# EAGLE design UWED (EAGLE 7.6.0)
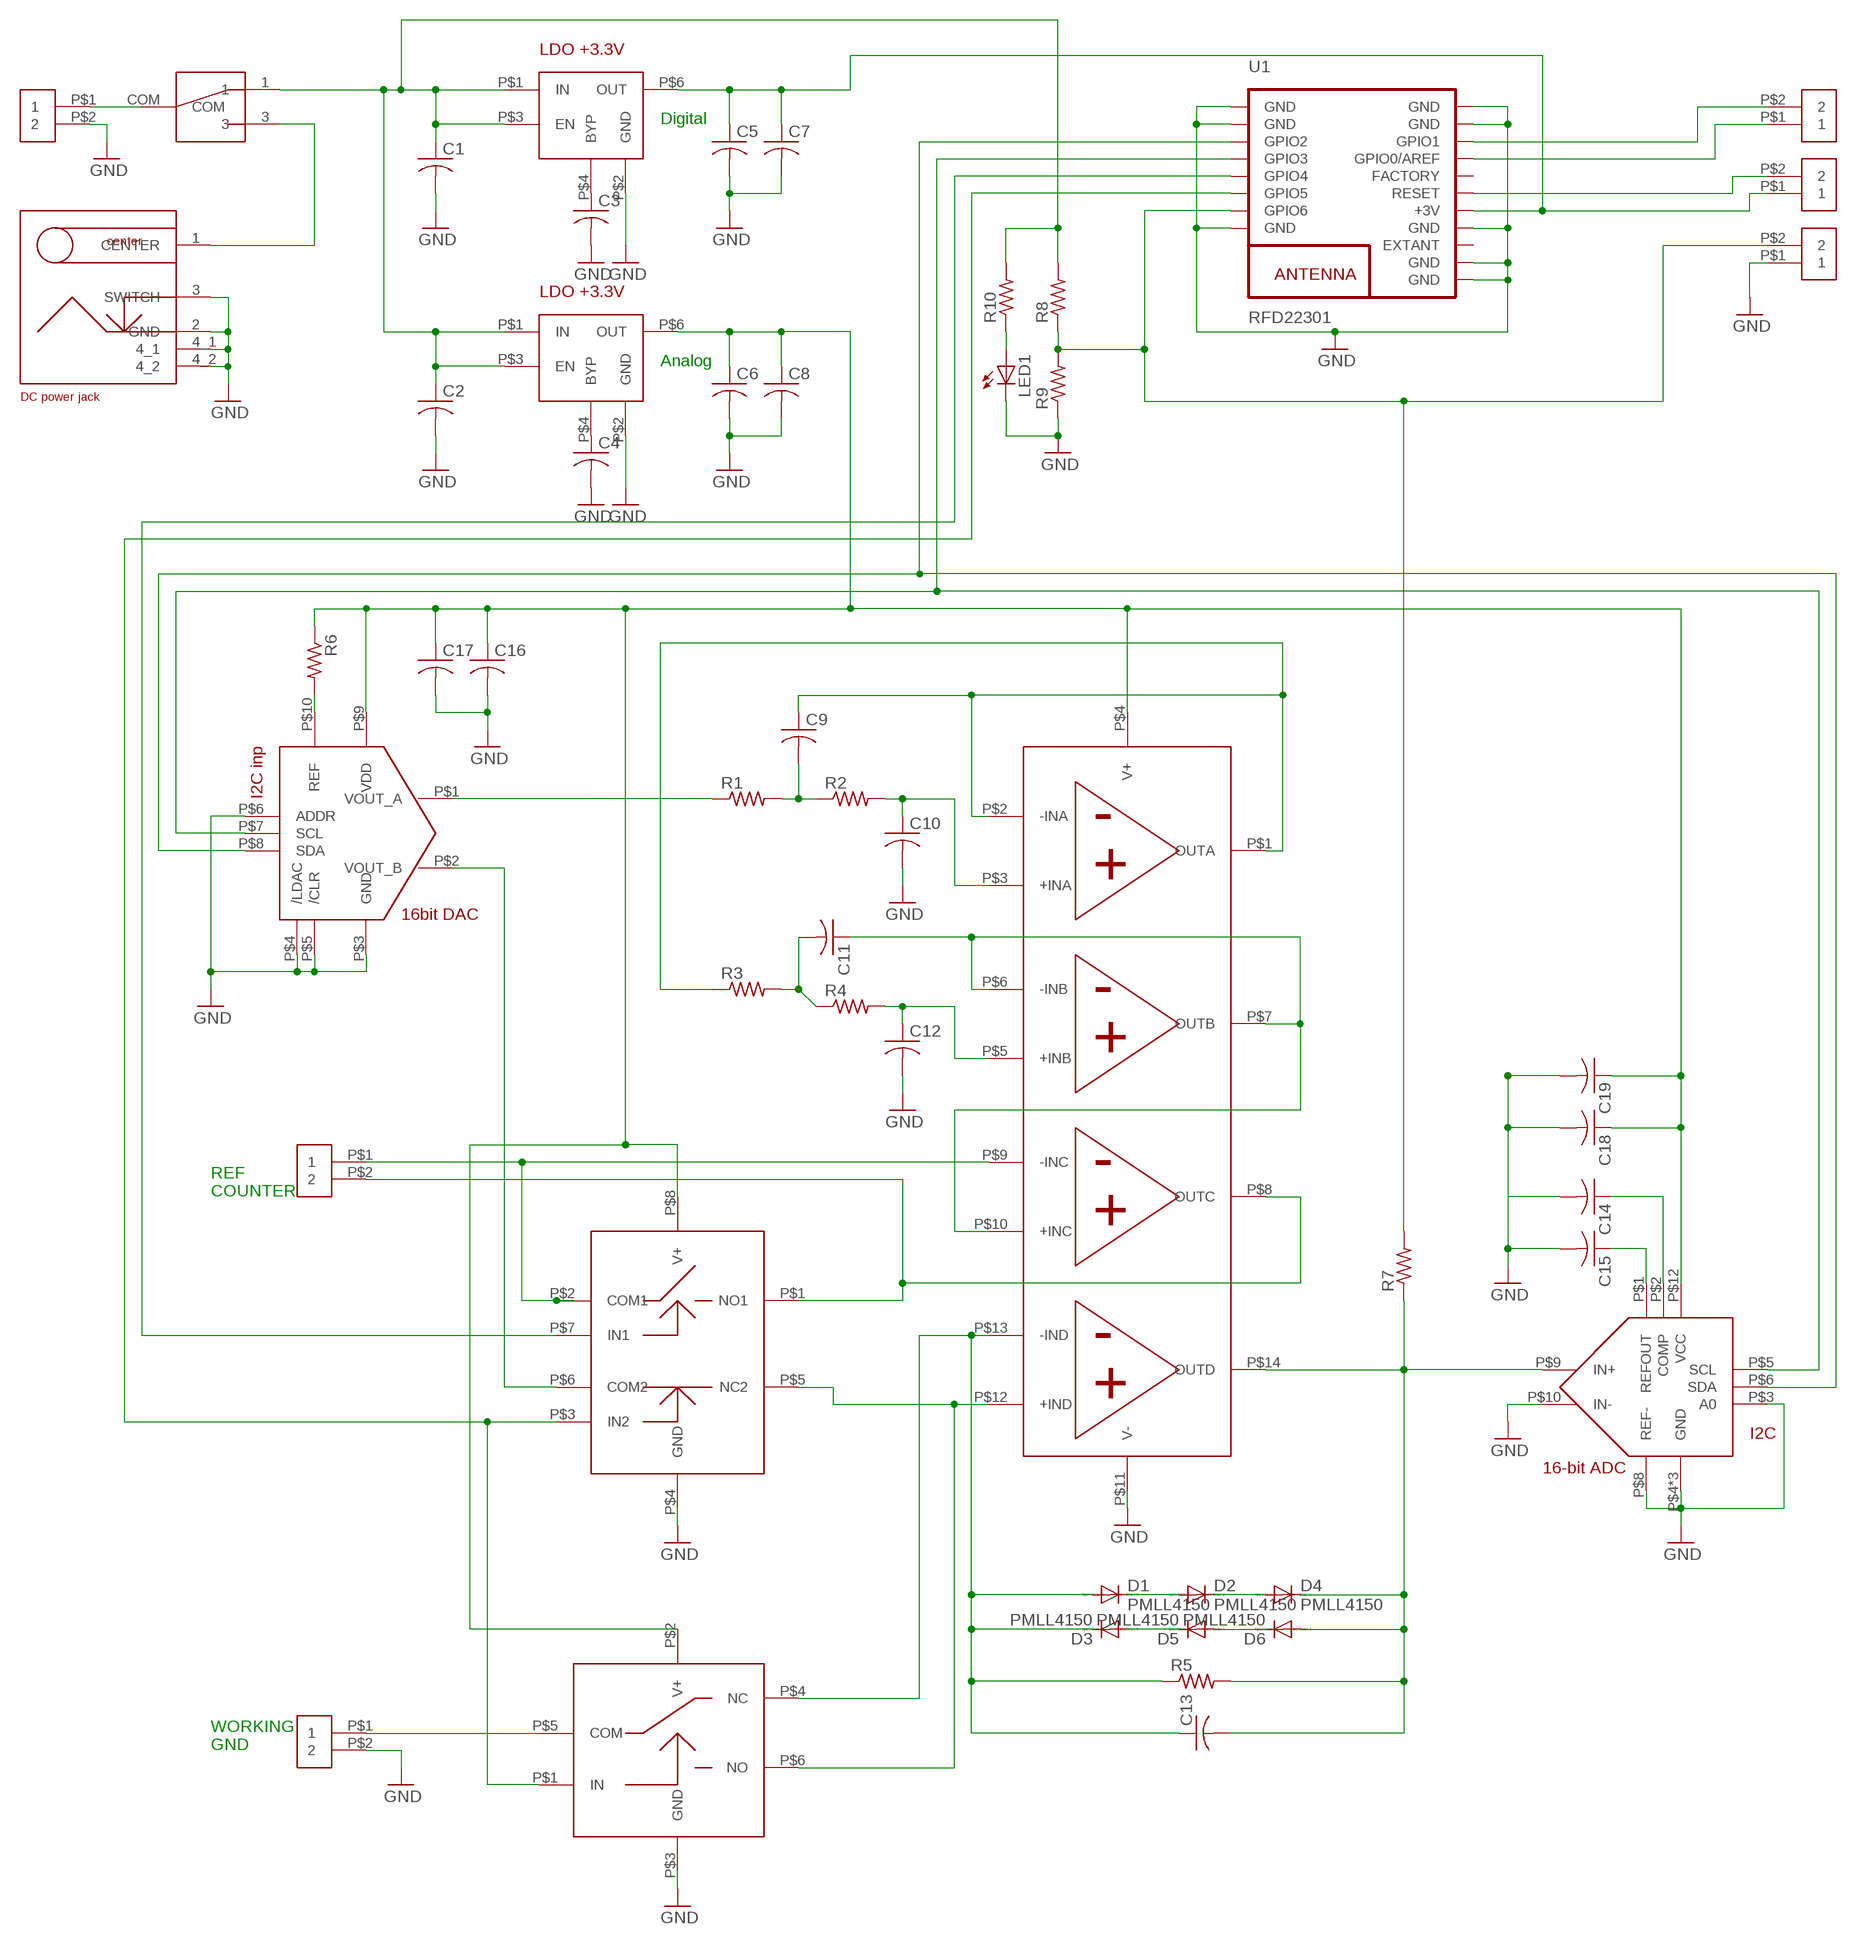
[diagram p0: schematic, sheet 1]

## Parts
C1  C-USC0805  [C0805]
C2  C-USC0805  [C0805]
C3  C-USC0805  [C0805]
C4  C-USC0805  [C0805]
C5  C-USC0805  [C0805]
C6  C-USC0805  [C0805]
C7  C-USC0805  [C0805]
C8  C-USC0805  [C0805]
C9  C-USC0805  [C0805]
C10  C-USC0805  [C0805]
C11  C-USC0805  [C0805]
C12  C-USC0805  [C0805]
C13  C-USC0805  [C0805]
C14  C-USC0805  [C0805]
C15  C-USC0805  [C0805]
C16  C-USC0805  [C0805]
C17  C-USC0805  [C0805]
C18  C-USC0805  [C0805]
C19  C-USC0805  [C0805]
D1  PMLL4150  [SOD80C]
D2  PMLL4150  [SOD80C]
D3  PMLL4150  [SOD80C]
D4  PMLL4150  [SOD80C]
D5  PMLL4150  [SOD80C]
D6  PMLL4150  [SOD80C]
LED1  LEDSML0805  [SML0805]
R1  R-US_R0805  [R0805]
R2  R-US_R0805  [R0805]
R3  R-US_R0805  [R0805]
R4  R-US_R0805  [R0805]
R5  R-US_R0805  [R0805]
R6  R-US_R0805  [R0805]
R7  R-US_R0805  [R0805]
R8  R-US_R0805  [R0805]
R9  R-US_R0805  [R0805]
R10  R-US_R0805  [R0805]
U1  RFD22301  [RFD22301]
U$1  4OPAMPS-AD8608ARUZ  [MSOP14_0.65MM]
U$2  ADC_LTC2471IMS  [MSOP12_0.65MM]
U$3  CONTACT_PADS_SMD_2  [CONTACT_PADS_SMD_2]
U$4  CONTACT_PADS_SMD_2  [CONTACT_PADS_SMD_2]
U$5  CONTACT_PADS_SMD_2  [CONTACT_PADS_SMD_2]
U$6  CONTACT_PADS_SMD_2  [CONTACT_PADS_SMD_2]
U$7  CONTACT_PADS_SMD_2  [CONTACT_PADS_SMD_2]
U$8  DAC_AD5667RBRMZ-2  [MSOP10_0.5MM]
U$9  DC_JACK_0.7MM  [PJ-032H-SMT]
U$10  LDO-MIC5205-3.3YM5-TR  [SOT-23-6]
U$11  LDO-MIC5205-3.3YM5-TR  [SOT-23-6]
U$12  SWITCH_MAX4643EUA  [MSOP8_0.65MM]
U$13  SWITCH_MAX4644EUT  [SOT-23-6]
U$14  SW_TOGGLELARGE  [TOGGLE_34E]
U$15  CONTACT_PADS_SMD_2  [CONTACT_PADS_SMD_2]

## Nets
GND: C1.2 C2.2 C3.2 C4.2 C5.2 C6.2 C7.2 C8.2 C10.2 C12.2 C14.2 C15.2 C16.2 C17.2 C18.2 C19.2 LED1.C R9.1 U1.1(GND) U1.2(GND) U1.8(GND) U1.9(GND) U1.10(GND) U1.12(GND) U1.18(GND) U1.19(GND) U$1.P$11(V-) U$2.P$3(A0) U$2.P$4(GND) U$2.P$7(GND) U$2.P$8(REF-) U$2.P$10(IN-) U$2.P$11(GND) U$3.P$2 U$6.P$2 U$8.P$3(GND) U$8.P$4(/LDAC) U$8.P$5(/CLR) U$8.P$6(ADDR) U$9.2(GND) U$9.3(SWITCH) U$9.4_1 U$9.4_2 U$10.P$2(GND) U$11.P$2(GND) U$12.P$4(GND) U$13.P$3(GND) U$15.P$1
N$1: U$3.P$1 U$14.COM
N$2: U$9.1(CENTER) U$14.3
N$3: C1.1 C2.1 R8.2 R10.2 U$10.P$1(IN) U$10.P$3(EN) U$11.P$1(IN) U$11.P$3(EN) U$14.1
N$4: C3.1 U$10.P$4(BYP)
N$5: C4.1 U$11.P$4(BYP)
N$6: C6.1 C8.1 C16.1 C17.1 C18.1 C19.1 R6.1 U$1.P$4(V+) U$2.P$12(VCC) U$8.P$9(VDD) U$11.P$6(OUT) U$12.P$8(V+) U$13.P$2(V+)
N$7: C5.1 C7.1 U1.13(+3V) U$4.P$1 U$10.P$6(OUT)
N$8: C9.1 R3.1 U$1.P$1(OUTA) U$1.P$2(-INA)
N$9: R1.1 U$8.P$1(VOUT_A)
N$10: C9.2 R1.2 R2.1
N$11: U$1.P$8(OUTC) U$7.P$2 U$12.P$1(NO1)
N$12: C10.1 R2.2 U$1.P$3(+INA)
N$13: C11.1 U$1.P$6(-INB) U$1.P$7(OUTB) U$1.P$10(+INC)
N$14: C11.2 R3.2 R4.1
N$15: C12.1 R4.2 U$1.P$5(+INB)
N$16: U$1.P$9(-INC) U$7.P$1 U$12.P$2(COM1)
N$17: U$6.P$1 U$13.P$5(COM)
N$18: C13.1 D1.A D3.C R5.1 U$1.P$13(-IND) U$13.P$4(NC)
N$19: U$1.P$12(+IND) U$12.P$5(NC2) U$13.P$6(NO)
N$20: U1.6(GPIO5) U$12.P$3(IN2) U$13.P$1(IN)
N$21: C13.2 D4.C D6.A R5.2 R7.1 U$1.P$14(OUTD) U$2.P$9(IN+)
N$22: D5.A D6.C
N$23: D3.A D5.C
N$24: D2.C D4.A
N$25: D1.C D2.A
N$26: U$8.P$2(VOUT_B) U$12.P$6(COM2)
N$27: U1.3(GPIO2) U$2.P$6(SDA) U$8.P$8(SDA)
N$28: C15.1 U$2.P$1(REFOUT)
N$29: C14.1 U$2.P$2(COMP)
N$30: R6.2 U$8.P$10(REF)
N$31: U1.4(GPIO3) U$2.P$5(SCL) U$8.P$7(SCL)
N$34: U1.17(GPIO1) U$5.P$2
N$35: U1.16(GPIO0/AREF) U$5.P$1
N$36: U1.14(RESET) U$4.P$2
N$39: U1.5(GPIO4) U$12.P$7(IN1)
N$43: R7.2 R8.1 R9.2 U1.7(GPIO6) U$15.P$2
N$45: LED1.A R10.1
Unconnected: U1.11(EXTANT) U1.15(FACTORY)

## Notes on the sheet
- Digital
- Analog
- REF
  COUNTER
- WORKING
  GND

## Library data of the parts
C1-C19 = rcl:C-US: CAPACITOR, American symbol
D1-D6 = diode:PMLL4150: DIODE high speed
LED1 = led:LED: LED OSRAM: - CHIPLED LG R971, LG N971, LY N971, LG Q971, LY Q971, LO R971, LY R971 LH N974, LH R974 LS Q976, LO Q976, LY Q976 LO Q996 - Hyper CHIPLED LW Q18S LB Q993, LB Q99A, LB R99A - SideLED LS A670, LO A670, LY A670, LG A670, LP A670 LB A673, LV A673, LT A673, LW A673 LH A674 LY A675 LS A676, LA A676, LO A676, LY A676, LW A676 LS A679, LY A679, LG A679 - Hyper Micro SIDELED® LS Y876, LA Y876, LO Y876, LY Y876 LT Y87S - SmartLED LW L88C, LW L88S LB L89C, LB L89S, LG L890 LS L89K, LO L89K, LY L89K LS L896, LA L896, LO L896, LY L896 - TOPLED LS T670, LO T670, LY T670, LG T670, LP T670 LSG T670, LSP T670, LSY T670, LOP T670, LYG T670 LG T671, LOG T671, LSG T671 LB T673, LV T673, LT T673, LW T673 LH T674 LS T676, LA T676, LO T676, LY T676, LB T676, LH T676, LSB T676, LW T676 LB T67C, LV T67C, LT T67C, LS T67K, LO T67K, LY T67K, LW E67C LS E67B, LA E67B, LO E67B, LY E67B, LB E67C, LV E67C, LT E67C LW T67C LS T679, LY T679, LG T679 LS T770, LO T770, LY T770, LG T770, LP T770 LB T773, LV T773, LT T773, LW T773 LH T774 LS E675, LA E675, LY E675, LS T675 LS T776, LA T776, LO T776, LY T776, LB T776 LHGB T686 LT T68C, LB T68C - Hyper Mini TOPLED® LB M676 - Mini TOPLED Santana® LG M470 LS M47K, LO M47K, LY M47K Source: http://www.osram.convergy.de LUXEON: - LUMILED® LXK2-PW12-R00, LXK2-PW12-S00, LXK2-PW14-U00, LXK2-PW14-V00 LXK2-PM12-R00, LXK2-PM12-S00, LXK2-PM14-U00 LXK2-PE12-Q00, LXK2-PE12-R00, LXK2-PE12-S00, LXK2-PE14-T00, LXK2-PE14-U00 LXK2-PB12-K00, LXK2-PB12-L00, LXK2-PB12-M00, LXK2-PB14-N00, LXK2-PB14-P00, LXK2-PB14-Q00 LXK2-PR12-L00, LXK2-PR12-M00, LXK2-PR14-Q00, LXK2-PR14-R00 LXK2-PD12-Q00, LXK2-PD12-R00, LXK2-PD12-S00 LXK2-PH12-R00, LXK2-PH12-S00 LXK2-PL12-P00, LXK2-PL12-Q00, LXK2-PL12-R00 Source: www.luxeon.com KINGBRIGHT: KA-3528ASYC Source: www.kingbright.com
R1-R10 = rcl:R-US_: RESISTOR, American symbol
U1 = RF_Digital_RFD22301_Eagle_Schematic_PCB_Library:RFD22301: RFD22301 RFduino SMT Module RFD22301 Datasheet: http://www.rfdigital.com/wp-content/uploads/2014/03/RFD22301.Data_.Sheet_.11.24.13_11.38PM.pdf
U$1 = AlarsLibrary:4OPAMPS-AD8608ARUZ
U$2 = AlarsLibrary:ADC_LTC2471IMS
U$3-U$7 U$15 = AlarsLibrary:CONTACT_PADS_SMD_2
U$8 = AlarsLibrary:DAC_AD5667RBRMZ-2
U$9 = AlarsLibrary:DC_JACK_0.7MM
U$10 U$11 = AlarsLibrary:LDO-MIC5205-3.3YM5-TR
U$12 = AlarsLibrary:SWITCH_MAX4643EUA
U$13 = AlarsLibrary:SWITCH_MAX4644EUT
U$14 = AlarsLibrary:SW_TOGGLE

## Board
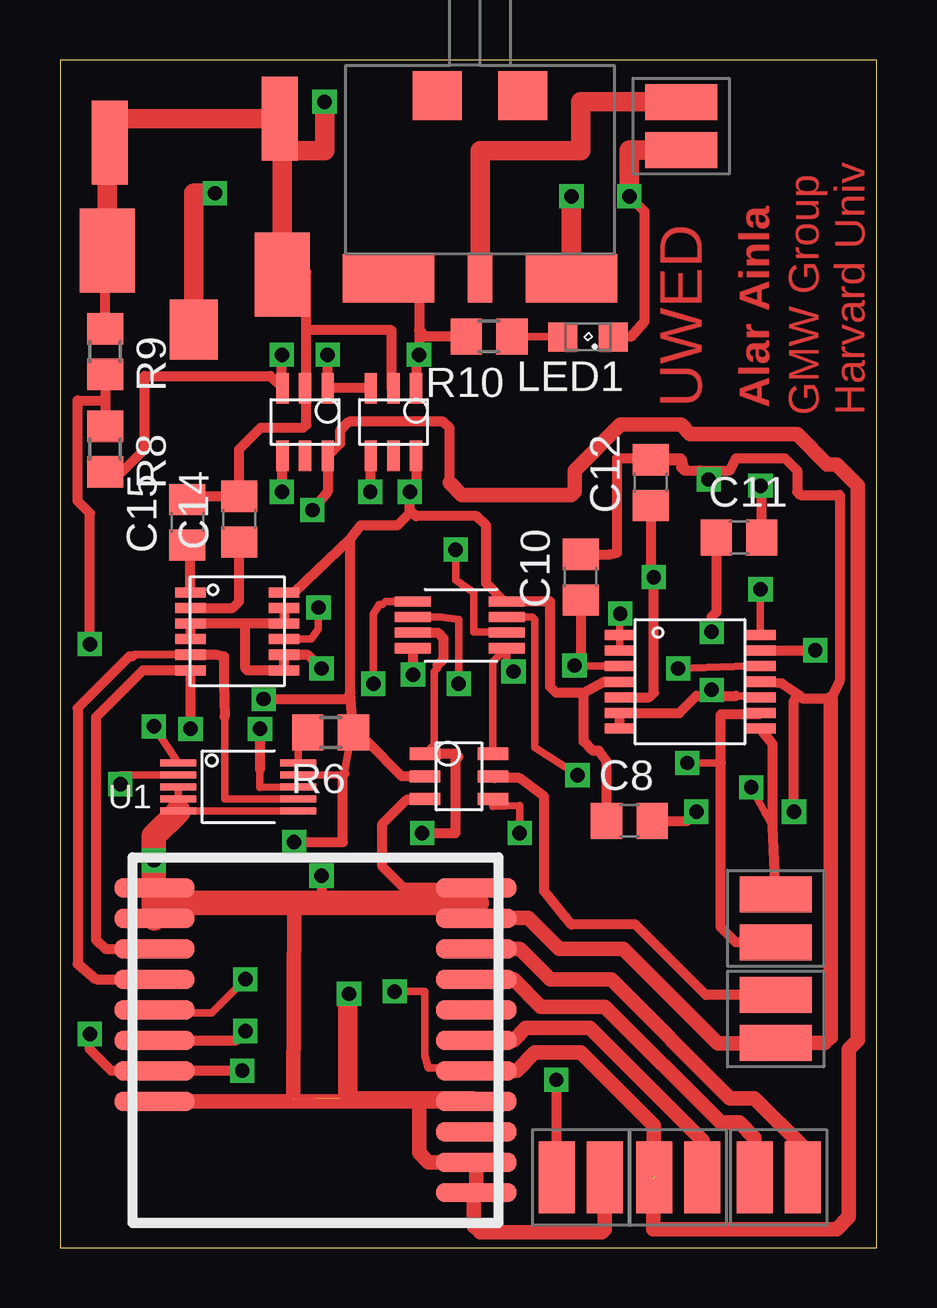
[diagram p1: board, top side]
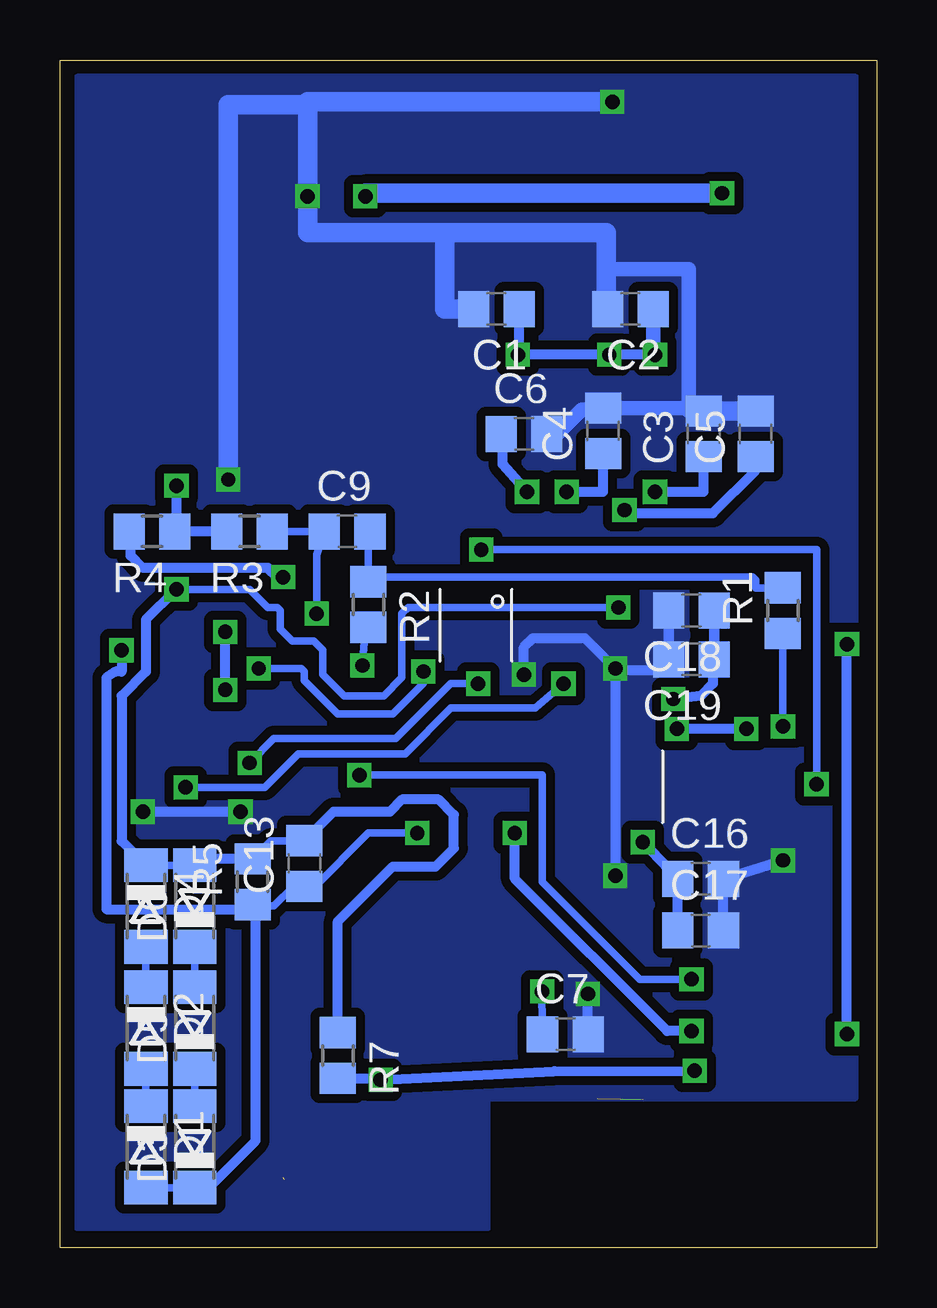
[diagram p2: board, bottom side, seen from below]

Size 34.04 x 49.52 mm. Coordinates in mm from the lower left corner, seen from the top.
Outline: 0,0 34.04,0 34.04,49.52 0,49.52 0,0
Copper layers (1*16): Top 0.0356mm / dielectric 1.5011mm / Bottom 0.0356mm
Design rules "SilverCircuits": minimum track width 7mil, minimum drill 14mil, track to track 7mil, track to pad 7mil, pad to pad 7mil, via to via 7mil, smd to smd 0mil, copper to edge 20mil, drill to drill 8mil, minimum pad ring 10mil, minimum via ring 8mil, stop-mask expansion 4mil, vias tented up to drill 0mil, thermal gap 10mil

### Footprints (pad centres in the part's own frame; a part is rotated, then mirrored left to right if it is on the bottom)
C0805 = smd 1.3 x 1.5: 1 -0.95,0; 2 0.95,0
SOD80C = smd 1.4 x 1.8: A 1.7,0; C -1.7,0
SML0805 = smd 1.2 x 1.2: A 1.05,0; C -1.05,0
R0805 = smd 1.3 x 1.5: 1 -0.95,0; 2 0.95,0
RFD22301 = smd 3.353 x 0.813: 1 -6.706,7.62; 2 -6.706,6.35; 3 -6.706,5.08; 4 -6.706,3.81; 5 -6.706,2.54; 6 -6.706,1.27; 7 -6.706,0; 8 -6.706,-1.27; 9 6.706,-5.08; 10 6.706,-3.81; 11 6.706,-2.54; 12 6.706,-1.27; 13 6.706,0; 14 6.706,1.27; 15 6.706,2.54; 16 6.706,3.81; 17 6.706,5.08; 18 6.706,6.35; 19 6.706,7.62
MSOP14_0.65MM = smd 1.27 x 0.419: P$1 -0.65,0; P$2 -0.65,-0.65; P$3 -0.65,-1.3; P$4 -0.65,-1.951; P$5 -0.65,-2.601; P$6 -0.65,-3.251; P$7 -0.649,-3.901; P$8 5.201,-3.901; P$9 5.201,-3.251; P$10 5.201,-2.6; P$11 5.201,-1.95; P$12 5.201,-1.3; P$13 5.201,-0.65; P$14 5.201,0
MSOP12_0.65MM = smd 1.27 x 0.419: P$1 0,0; P$2 0,-0.65; P$3 0,-1.3; P$4 0,-1.951; P$5 0,-2.601; P$6 0,-3.251; P$7 3.901,-3.251; P$8 3.901,-2.601; P$9 3.901,-1.951; P$10 3.901,-1.3; P$11 3.901,-0.65; P$12 3.901,0
CONTACT_PADS_SMD_2 = smd 1.5 x 3: P$1 -1,0; P$2 1,0
MSOP10_0.5MM = smd 1.5 x 0.3: P$1 0,0; P$2 0,-0.5; P$3 0,-1; P$4 0,-1.5; P$5 0,-2; P$6 5,-2; P$7 5,-1.5; P$8 5,-1; P$9 5,-0.5; P$10 5,0
PJ-032H-SMT = smd 2.5 x 2: 1 12.3,0 | smd 3.5 x 2.3: 2 9,-3.6; 3 10,3.7 | smd 3.5 x 1.5: 4_1 4.5,-3.5; 4_2 3.5,3.6
SOT-23-6 = smd 1.27 x 0.508: P$1 0,0; P$2 0,-0.94; P$3 0,-1.88; P$4 2.819,-1.88; P$5 2.819,-0.94; P$6 2.819,0
MSOP8_0.65MM = smd 1.5 x 0.42: P$1 0,0; P$2 0,-0.65; P$3 0,-1.3; P$4 0,-1.95; P$5 3.9,-1.95; P$6 3.9,-1.3; P$7 3.9,-0.65; P$8 3.9,0
TOGGLE_34E = smd 3.81 x 2.032: 1 -2.032,-7.62; 3 5.588,-7.62 | smd 1.016 x 2.032: COM 1.778,-7.62 | smd 2.032 x 2.032: NC 0,0; NC2 3.556,0

### Placement (x,y rotation side)
C1  15.85,39.14 180 bottom
C2  10.26,39.14 180 bottom
C3  7.21,33.93 90 bottom
C4  11.4,34.06 90 bottom
C5  5.05,33.93 90 bottom
C6  14.71,33.93 0 bottom
C7  12.98,8.92 0 bottom
C8  23.72,17.81 0 top
C9  22.07,29.87 0 bottom
C10  21.69,27.97 90 top
C11  28.3,29.62 0 top
C12  24.61,31.9 90 top
C13  23.85,16.03 90 bottom
C14  7.47,30.38 90 top
C15  5.31,30.25 90 top
C16  7.34,15.39 0 bottom
C17  7.34,13.23 0 bottom
C18  7.72,26.57 180 bottom
C19  7.72,24.54 180 bottom
D1  30.45,4.22 270 bottom
D2  30.45,9.17 270 bottom
D3  28.42,4.22 90 bottom
D4  30.45,14.25 270 bottom
D5  28.42,9.17 90 bottom
D6  28.42,14.25 90 bottom
LED1  22,37.97 180 top
R1  3.91,26.57 90 bottom
R2  21.18,26.82 270 bottom
R3  26.14,29.87 180 bottom
R4  30.2,29.87 180 bottom
R5  26.01,15.27 90 bottom
R6  11.28,21.49 180 top
R7  22.45,8.03 270 bottom
R8  1.88,33.3 270 top
R9  1.88,37.36 270 top
R10  17.88,38 180 top
U1  10.64,7.39 0 top
U$1  23.98,25.55 0 top
U$2  5.44,27.33 0 top
U$3  25.88,46.76 270 top
U$4  25.76,2.95 0 top
U$5  29.95,2.95 0 top
U$6  29.82,9.55 270 top
U$7  29.82,13.74 90 top
U$8  4.93,20.22 0 top
U$9  5.56,50.57 270 top
U$10  11.15,35.84 270 top
U$11  14.83,35.84 270 top
U$12  14.71,26.95 0 top
U$13  15.21,20.6 0 top
U$14  15.72,48.03 0 top
U$15  21.69,2.95 180 top

### Tracks (layer width: path | path; a pad name or v marks a point on that pad's centre or on a via)
GND  (via drill 0.6)  (1 unrouted)
  Top 0.305: U$8.P$3 U$8.P$4 U$8.P$5 U$8.P$6 | 30.07,23.52 30.11,23.52 | 11.99,6.2 11.66,6.25 11.79,6.12 | 23.77,37.97 LED1.C
  Top 0.406: 10.26,38.25 10.26,35.84 U$10.P$2 10.26,35.79 10.26,34.32 10.13,34.19 8.36,34.19 7.47,33.3 C14.2 5.44,31.33 C15.2 | 10.26,38.25 10.26,40.66 9.26,40.66 U$9.3 | U$11.P$2 13.82,35.84 13.82,38.25 10.26,38.25 | U$2.P$11 U$2.P$10 7.72,26.03 | 7.72,26.03 U$2.P$3 U$2.P$4 | 7.72,26.03 7.72,24.15 7.8,24.08 U$2.P$7 U$2.P$8 10.32,24.73 v10.9,24.15 | 30.79,23.03 30.96,22.88 32.11,22.88 32.49,23.65 32.49,31.39 30.84,31.39 30.71,31.52 30.71,32.41 30.2,32.92 28.17,32.92 27.91,32.41 26.64,32.41 | 30.79,23.03 30.07,23.52 | 30.11,23.52 U$1.P$11 | R9.1 1.88,41.49 U$9.2 | 23.77,37.97 24.36,38.63 24.36,43.21 v23.72,43.84 | v10.9,15.52 10.9,14.5 10.77,14.38 | U$12.P$4 v14.71,23.9 | U1.19 14.33,15.01 13.44,15.9 13.44,17.68 14.45,18.69 15.19,18.69 U$13.P$3 | C10.2 22.9,28.91 23.22,28.98 23.22,32.92 25.88,32.92 | 25.88,32.92 26.01,32.41 | C12.2 25.82,32.85 25.88,32.92 | v3.91,16.15 3.91,17.17 | C8.2 26.14,17.8 v26.52,18.19 | v30.58,18.19 30.58,22.81 30.79,23.03 | 25.88,32.92 25.88,32.54 26.01,32.41 | 26.01,32.41 26.64,32.41 | 26.64,32.41 v27.03,32.03
  Top 0.61: U1.1 U1.2 3.94,14.28 4.04,14.38 | U1.19 17.37,14.99 17.37,14.38 17.37,13.77 | 17.37,13.77 U1.18 | 15.09,6.25 14.96,6.12 14.96,3.96 15.34,3.58 U1.10 U1.9 17.25,2.21 17.25,0.91 17.5,0.66 22.58,0.66 22.69,0.77 U$15.P$1 | 15.09,6.25 17.22,6.25 U1.12 11.79,6.12 U1.8 | 15.09,6.25 11.99,6.25 11.99,6.2 | 9.73,6.2 9.75,14.38 14.71,14.38 | 17.37,13.77 19.51,13.77 20.8,12.47 23.47,12.47 27.41,8.53 29.8,8.53 U$6.P$2 31.87,8.55 32.11,8.79 32.11,22.88
  Top 0.813: U$9.2 1.96,46.07 U$9.4_1 2.06,47.07 U$9.4_2 9.26,47.07 9.26,45.75 | 9.26,45.75 U$9.3 | U$3.P$2 23.72,45.76 v23.72,43.84 | v11.02,47.78 11.02,45.75 9.26,45.75 | v12.04,10.59 11.99,10.59 11.99,6.25
  Top 1.016: U$8.P$5 4.93,18.19 3.91,17.17 3.91,13.77 U1.2 | 4.04,14.38 9.75,14.38 10.77,14.38 14.71,14.38 17.37,14.38
  Bottom 0.406: v10.9,24.15 v10.9,15.52 | v14.71,23.9 14.71,25.04 14.33,25.42 12.17,25.42 v10.9,24.15 | C17.2 C16.2 v3.91,16.15 | C19.2 C18.2 8.67,24.14 8.61,24.08 10.82,24.08 v10.9,24.15 | v26.52,18.19 v30.58,18.19 | C7.2 12.04,8.92 v12.04,10.59
  Bottom 0.61: C3.2 7.72,34.88 | 7.72,34.88 7.85,34.88 7.85,40.79 11.28,40.79 11.28,40.66 | 7.72,34.88 7.72,35.01 C4.2 11.47,34.95 12.29,34.95 13.31,33.93 C6.2
  Bottom 0.813: 23.72,47.4 v23.72,43.84 23.72,42.32 18.01,42.32 | 23.72,47.4 23.72,47.78 v11.02,47.78 | C1.2 18.01,39.14 18.01,42.32 | C2.2 11.28,39.14 11.28,40.66 11.28,42.32 18.01,42.32 | C5.2 C3.2 | v27.03,32.03 27.03,47.65 23.98,47.65 23.72,47.4
  pour Bottom (isolate 0.381, no thermals): 0.89,48.82 33.32,48.82 33.32,0.84 16.21,0.84 16.21,6.25 0.89,6.25 0.89,48.74 0.86,48.79
N$1
  Top 0.813: U$14.COM 17.5,45.75 21.69,45.75 21.69,47.78 U$3.P$1
N$2  (via drill 0.6)
  Top 0.813: U$9.1 5.56,43.97 v6.45,43.97 | v21.31,43.84 U$14.3
  Bottom 0.813: v6.45,43.97 21.31,43.97 v21.31,43.84
N$3  (via drill 0.6)
  Top 0.406: v11.15,37.24 U$10.P$1 U$11.P$3 | U$11.P$1 14.83,37.24 v14.96,37.24 14.96,38.25 | v9.25,37.24 9.25,35.84 U$10.P$3 8.76,36.35 3.53,36.35 3.53,33.3 2.58,32.35 R8.2 | U$14.1 14.96,40.41 14.96,38.25 | R10.2 15.21,38 14.96,38.25
  Bottom 0.406: v9.25,37.24 v11.15,37.24 v14.96,37.24 14.9,37.24 C1.1
  Bottom 0.61: v9.25,37.24 9.31,37.24 C2.1
N$4  (via drill 0.6)
  Top 0.406: U$10.P$4 9.25,33.02 v9.25,31.52
  Bottom 0.406: v9.25,31.52 7.21,31.52 C3.1
N$5  (via drill 0.6)
  Top 0.406: U$11.P$4 12.93,33.02 v12.93,31.52
  Bottom 0.406: v12.93,31.52 11.41,31.52 C4.1
N$6  (via drill 0.6)
  Top 0.305: R6.1 12.1,21.74 12.1,21.17 11.85,19.77 | 11.79,19.71 11.21,19.71 U$8.P$9
  Top 0.406: U$11.P$6 14.83,31.9 v14.58,31.52 14.58,30.76 | U$2.P$12 9.75,27.33 12.1,29.55 | 14.58,30.76 14.58,30.63 14.07,30.12 12.55,30.12 12.1,29.55 | U$1.P$4 22.66,23.6 21.82,23.14 | 21.82,23.14 20.68,23.14 20.42,23.39 20.42,26.95 U$12.P$8 18.52,26.95 17.75,27.71 17.75,30.12 17.37,30.5 14.83,30.5 14.58,30.76 | R6.1 12.1,23.14 | 12.1,23.14 12.1,29.55 | U$13.P$2 14.25,19.66 12.8,21.11 12.74,21.11 12.1,21.74 | v9.75,16.92 11.79,16.92 11.79,19.71 11.85,19.77 | v8.48,22.88 11.97,22.88 12.1,23.14 | C8.1 22.77,20.28 22.45,20.73 22.2,20.73 21.82,21.11 21.82,23.14
  Bottom 0.406: v14.58,31.52 15.6,32.66 15.6,33.87 C6.1 | v9.75,16.92 C16.1 C17.1 | C19.1 C18.1 6.77,24.34 6.83,24.28 6.83,23.52 7.34,23.01 v8.48,22.88
N$7  (via drill 0.6)  (1 unrouted)
  Top 0.305: v13.95,10.69 15.19,10.69 15.19,8.03 15.34,7.52 17.22,7.52 U1.13
  Top 0.406: v10.52,30.76 11.15,31.52 U$10.P$6 11.66,33.53 11.66,34.06 12.04,34.44 15.98,34.44 16.23,34.19 16.23,31.9
  Top 0.61: U1.13 19.02,7.39 19.79,8.15 21.69,8.15 24.74,5.11 24.74,2.96 U$4.P$1 | 24.69,2.87 24.71,0.79 32.36,0.79 32.87,1.29 32.87,8.28 33.25,8.66 33.25,31.78 32.36,32.66 31.98,32.66 30.71,33.93 26.26,33.93 25.88,34.32 23.34,34.32 21.44,32.41 21.44,31.52 21.31,31.39 16.74,31.39 16.23,31.9
  Bottom 0.305: C7.1 13.96,10.37 v13.95,10.69
  Bottom 0.406: 10.64,30.89 v10.52,30.76 10.39,30.63 6.83,30.63 5.05,32.41 C5.1
N$8  (via drill 0.6)
  Top 0.305: U$1.P$2 U$1.P$1 23.33,26.43 v23.34,26.44
  Bottom 0.305: v23.34,26.44 23.34,28.91 C9.1 R3.1
N$9  (via drill 0.6)
  Top 0.305: U$8.P$1 v3.91,21.74
  Bottom 0.305: v3.91,21.74 R1.1
N$10
  Bottom 0.305: R1.2 5.05,27.52 5.05,27.84 5.18,27.96 20.99,27.96 R2.1 21.18,29.81 C9.2
N$11  (via drill 0.6)
  Top 0.305: 29.69,17.55 v28.8,19.2 | v13.06,23.52 13.06,26.42 13.31,26.82 13.44,26.82 13.56,26.95 U$12.P$1
  Top 0.406: U$7.P$2 29.69,17.55 29.69,21.01 U$1.P$8
  Bottom 0.305: v28.8,19.2 25.5,19.2 24.11,20.6 19.66,20.6 17.75,22.5 14.22,22.5 v13.06,23.52
N$12  (via drill 0.6)
  Top 0.305: U$1.P$3 21.59,24.25 21.69,24.28 v21.44,24.28
  Top 0.406: C10.1 21.69,24.54 v21.44,24.28
  Bottom 0.305: v21.44,24.28 21.31,25.74 R2.2
N$13  (via drill 0.6)
  Top 0.305: 28.17,23.01 29.12,23.01 U$1.P$10
  Top 0.406: U$1.P$7 U$1.P$6 25.81,22.3 26.52,23.01 27.15,23.01 | 27.15,23.01 28.17,23.01 | C11.1 27.35,26.51 27.15,26.31 v27.15,25.68 | 27.15,23.01 v27.15,23.27
  Bottom 0.406: v27.15,23.27 v27.15,25.68
N$14  (via drill 0.6)
  Top 0.406: C11.2 29.25,31.71 v29.18,31.78
  Bottom 0.406: R3.2 R4.1 29.18,29.94 v29.18,31.78
N$15  (via drill 0.6)
  Top 0.406: U$1.P$5 24.55,22.95 24.74,23.14 v24.74,27.96 24.61,28.09 C12.1
  Bottom 0.406: v24.74,27.96 24.99,27.96 25.38,28.35 30.58,28.35 31.09,28.85 31.09,29.81 R4.2
N$16  (via drill 0.6)
  Top 0.305: U$12.P$2 15.87,26.3 16.61,26.19 v16.61,23.52 | v26.14,20.22 27.53,20.22
  Top 0.406: U$7.P$1 28.15,12.74 27.53,13.36 27.53,20.22 27.53,22.25 29.13,22.25 U$1.P$9
  Bottom 0.305: v16.61,23.52 17.75,23.52 20.04,21.23 25.12,21.23 v26.14,20.22
N$17
  Top 0.406: U$6.P$1 26.91,10.55 23.98,13.49 21.31,13.49 20.17,14.88 20.17,18.82 19.15,19.58 18.11,19.58 U$13.P$5
N$18  (via drill 0.6)
  Top 0.305: U$13.P$4 18.03,18.41 19.15,18.44 v19.15,17.3
  Top 0.406: U$1.P$13 31.58,24.9 v31.47,24.92
  Bottom 0.305: D3.C D1.A | R5.1 25.94,14.25 25.12,14.25 24.29,15.08 C13.1 23.79,15.01 23.47,15.01 21.18,17.3 v19.15,17.3
  Bottom 0.406: D3.C 27.84,2.52 25.88,4.47 25.88,14.19 R5.1 26.2,14.12 32.11,14.12 32.11,23.77 31.72,24.03 31.47,24.03 v31.47,24.92
N$19  (via drill 0.6)
  Top 0.305: U$13.P$6 18.03,24.43 U$12.P$5 18.61,24.32 v18.9,24.03 | v25.76,24.15 29.28,24.28 U$1.P$12
  Bottom 0.305: v18.9,24.03 18.9,23.52 20.17,22.25 22.45,22.25 23.85,23.65 23.85,24.03 23.98,24.15 v25.76,24.15
N$20  (via drill 0.6)
  Top 0.305: 15.72,24.28 15.72,24.15 15.6,24.03 15.6,20.98 U$13.P$1
  Top 0.406: U1.6 7.34,8.66 v7.72,9.04 | U$13.P$1 16.48,20.6 16.61,20.47 16.48,20.34 16.48,17.3 v15.09,17.3 | U$12.P$3 15.75,25.65 15.98,25.42 15.98,24.54 15.72,24.28
  Bottom 0.406: v7.72,9.04 8.74,9.04 15.09,15.39 v15.09,17.3
N$21  (via drill 0.6)
  Top 0.305: U$2.P$9 10.47,25.38 10.77,25.81 v10.77,26.7 | v29.18,27.46 U$1.P$14
  Bottom 0.305: v10.77,26.7 19.53,26.7 19.79,26.44 19.79,23.77 20.55,23.01 22.2,23.01 23.09,23.9 23.09,24.92 23.47,25.3 24.36,25.3 24.87,25.81 24.87,26.57 24.99,26.7 25.38,26.7 26.14,27.46 v29.18,27.46 | D4.C D6.A | C13.2 25.25,16.98 R5.2
  Bottom 0.406: R5.2 28.16,16.21 D6.A | v29.18,27.46 30.45,26.19 30.45,24.03 31.47,23.01 31.47,16.96 D4.C | R7.1 22.45,13.61 20.17,15.9 18.39,15.9 17.63,16.66 17.63,18.06 18.26,18.69 19.79,18.69 20.29,18.19 22.64,18.19 C13.2
N$22
  Bottom 0.305: D5.A D6.C
N$23
  Bottom 0.305: D3.A D5.C
N$24
  Bottom 0.305: D2.C D4.A
N$25
  Bottom 0.305: D1.C D2.A
N$26  (via drill 0.6)
  Top 0.305: U$8.P$2 2.52,19.72 v2.52,19.33 | v16.48,29.11 16.48,27.84 17.25,27.33 17.25,25.68 18.58,25.68 U$12.P$6
  Bottom 0.305: v2.52,19.33 2.52,29.11 v16.48,29.11
N$27  (via drill 0.6)
  Top 0.305: 8.33,19.96 8.33,19.23 8.33,19.2 U$8.P$8
  Top 0.406: v5.44,21.64 U$2.P$6 3.45,24.08 1.5,22.12 1.5,12.85 1.88,12.47 U1.3 | v8.33,21.64 8.33,19.96
  Bottom 0.406: v5.44,21.64 v8.33,21.64
N$28
  Top 0.406: U$2.P$1 5.44,29.17 C15.1
N$29
  Top 0.406: U$2.P$2 7.2,26.68 7.47,26.95 C14.1
N$30
  Top 0.305: U$8.P$10 9.93,21.98 R6.2
N$31
  Top 0.305: 6.86,22.15 6.86,18.72 9.9,18.72 U$8.P$7 | U$2.P$5 3.09,24.73 3.02,24.66
  Top 0.406: U$2.P$5 6.51,24.73 6.83,24.66 6.83,23.52 6.86,22.15 | 3.02,24.66 2.9,24.66 0.74,22.5 0.74,11.84 1.5,11.2 U1.4
N$34
  Top 0.61: U1.17 19.15,12.47 20.42,11.2 22.96,11.2 27.91,6.25 28.93,6.25 30.96,4.22 30.96,2.96 U$5.P$2
N$35
  Top 0.61: U1.16 18.9,11.2 20.04,10.06 22.71,10.06 27.53,5.23 28.3,5.23 28.93,4.6 28.93,2.96 U$5.P$1
N$36
  Top 0.61: U1.14 18.9,8.66 19.41,9.17 22.07,9.17 26.77,4.47 26.77,2.96 U$4.P$2
N$39  (via drill 0.6)
  Top 0.305: U$12.P$7 19.67,26.3 19.79,26.19 19.79,20.85 v21.56,19.71 | v7.72,11.2 6.32,9.8 4.06,9.8 U1.5
  Bottom 0.305: v21.56,19.71 13.95,19.71 13.95,15.27 9.88,11.2 v7.72,11.2
N$43  (via drill 0.6)
  Top 0.406: U$15.P$2 20.69,6.99 v20.68,7.01 | v7.6,7.39 U1.7 2.13,7.39 1.25,8.28 v1.25,8.92 | R9.2 1.88,35.33 | 1.88,35.33 R8.1 | v1.25,25.17 1.25,30.63 0.74,31.14 0.74,35.33 1.88,35.33
  Bottom 0.406: v7.6,7.39 13.44,7.37 v20.68,7.01 20.74,7.08 R7.2 | v1.25,8.92 v1.25,25.17
N$45
  Top 0.305: R10.1 20.95,38 LED1.A

### Text on the board
Top: UWED | Alar Ainla | GMW Group / Harvard Univ